# Altium schematic sheet Relay.SchDoc
size A4; Organization: Altium Limited; Address1: L3, 12a Rodborough Rd; Address2: Frenchs Forest; Address3: NSW; Address4: Australia 2086; Version: 1
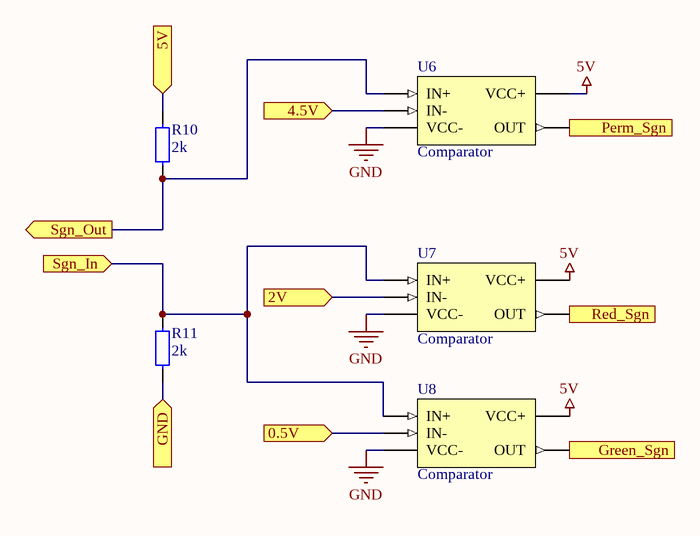
[diagram p0: Relay.SchDoc]

## Parts
R10  2k  [0603 Resistor]
R11  2k  [0603 Resistor]
U6  Comparator  [SOT-23-5]
U7  Comparator  [SOT-23-5]
U8  Comparator  [SOT-23-5]

## Ports
0.5V (in), 2V (in), 4.5V (in), 5V (in), GND (in), Green_Sgn (out), Perm_Sgn (out), Red_Sgn (out), Sgn_In (in), Sgn_Out (out)

## Nets
5V: U6.5(VCC+) U7.5(VCC+) U8.5(VCC+)
GND: U6.2(VCC-) U7.2(VCC-) U8.2(VCC-)
0.5V: U8.4(IN-) ; port 0.5V
2V: U7.4(IN-) ; port 2V
4.5V: U6.4(IN-) ; port 4.5V
5V: R10.1 ; port 5V  [a separate net that carries the same name]
GND: R11.2 ; port GND  [a separate net that carries the same name]
Green_Sgn: U8.1(OUT) ; port Green_Sgn
Perm_Sgn: U6.1(OUT) ; port Perm_Sgn
Red_Sgn: U7.1(OUT) ; port Red_Sgn
Sgn_In: R11.1 U7.3(IN+) U8.3(IN+) ; port Sgn_In
Sgn_Out: R10.2 U6.3(IN+) ; port Sgn_Out

## Notes on the sheet
- Size:
- Date:
- A4
- Car#:
- Time:
- 418
- Team:
- Sheet
- BRT
- of
- University:
- Technical University
- Bauman Moscow State
- Document Version:

## Library data of the parts
R10 R11 = Res 2k (0603): 0.1W 0603 2k, 1%; Part Number: RC0603FR-072KL; Manufacturer: Taiwan; Type: Resistor; ComponentLink1Description: Chip&Dip; ComponentLink1URL: https://www.chipdip.ru/product0/9000079719
U6-U8 = Comparator [LMV]: LMV7219 7-ns 2.7-V to 5-V Comparator with Rail-to-Rail Output; Part Number: LMV7219M5X/NOPB; Manufacturer: Texas Instruments; ComponentLink1Description: DataSheet; ComponentLink1URL: http://www.ti.com/lit/ds/symlink/lmv7219.pdf; ComponentLink2Description: Mouser; ComponentLink2URL: https://ru.mouser.com/ProductDetail/Texas-Instruments/LMV7219M5X-NOPB?qs=sGAEpiMZZMuayl%2FEk2kXcbEcxwmoPguctVQUIBgrLJY%3D; Type: IC